# EAGLE design ocs-arduino-shield (EAGLE 7.1.0)
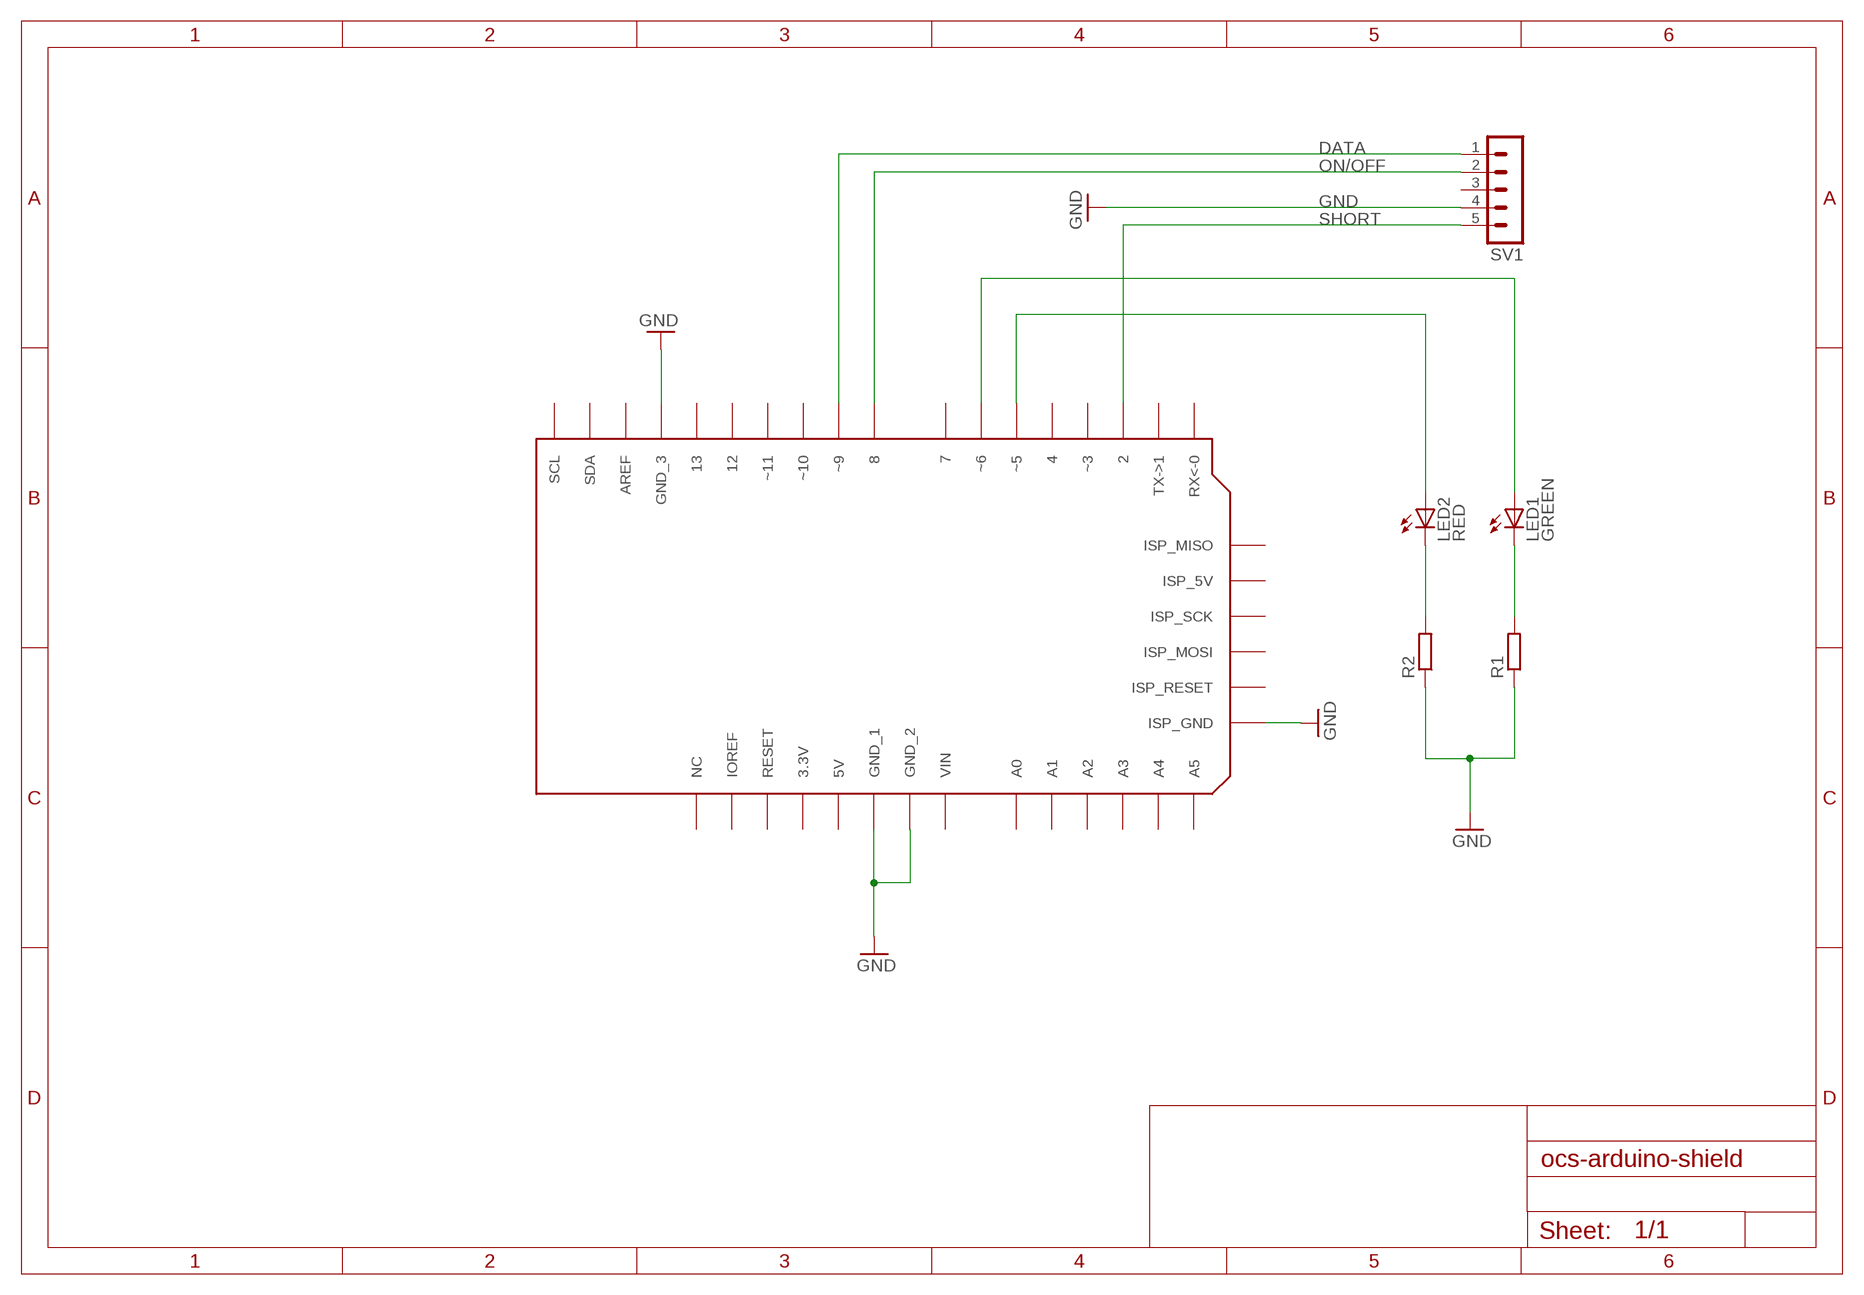
[diagram p0: schematic, sheet 1]

## Parts
LED1  GREEN  LED3MM  [LED3MM]
LED2  RED  LED3MM  [LED3MM]
R1  R-EU_0207_10  [0207/10]
R2  R-EU_0207_10  [0207/10]
SH1  ARDUINO-UNO-SHIELD  [ARDUINO-UNO-SHIELD]
SV1  MA05-1  [MA05-1]

## Nets
DATA: SH1.~9 SV1.1
GND: R1.1 R2.1 SH1.GND_1 SH1.GND_2 SH1.GND_3 SH1.ISP_GND SV1.4
N$1: LED1.A SH1.~6
N$2: LED2.A SH1.~5
N$3: LED2.K(C) R2.2
N$4: LED1.K(C) R1.2
ON/OFF: SH1.8 SV1.2
SHORT: SH1.2 SV1.5
Unconnected: SH1.3.3V SH1.4 SH1.5V SH1.7 SH1.12 SH1.13 SH1.A0 SH1.A1 SH1.A2 SH1.A3 SH1.A4 SH1.A5 SH1.AREF SH1.IOREF SH1.ISP_5V SH1.ISP_MISO SH1.ISP_MOSI SH1.ISP_RESET SH1.ISP_SCK SH1.NC SH1.RESET SH1.RX<-0 SH1.SCL SH1.SDA SH1.TX->1 SH1.VIN SH1.~3 SH1.~10 SH1.~11 SV1.3

## Library data of the parts
LED1 LED2 = led:LED: LED OSRAM: - CHIPLED LG R971, LG N971, LY N971, LG Q971, LY Q971, LO R971, LY R971 LH N974, LH R974 LS Q976, LO Q976, LY Q976 LO Q996 - Hyper CHIPLED LW Q18S LB Q993, LB Q99A, LB R99A - SideLED LS A670, LO A670, LY A670, LG A670, LP A670 LB A673, LV A673, LT A673, LW A673 LH A674 LY A675 LS A676, LA A676, LO A676, LY A676, LW A676 LS A679, LY A679, LG A679 - Hyper Micro SIDELED® LS Y876, LA Y876, LO Y876, LY Y876 LT Y87S - SmartLED LW L88C, LW L88S LB L89C, LB L89S, LG L890 LS L89K, LO L89K, LY L89K LS L896, LA L896, LO L896, LY L896 - TOPLED LS T670, LO T670, LY T670, LG T670, LP T670 LSG T670, LSP T670, LSY T670, LOP T670, LYG T670 LG T671, LOG T671, LSG T671 LB T673, LV T673, LT T673, LW T673 LH T674 LS T676, LA T676, LO T676, LY T676, LB T676, LH T676, LSB T676, LW T676 LB T67C, LV T67C, LT T67C, LS T67K, LO T67K, LY T67K, LW E67C LS E67B, LA E67B, LO E67B, LY E67B, LB E67C, LV E67C, LT E67C LW T67C LS T679, LY T679, LG T679 LS T770, LO T770, LY T770, LG T770, LP T770 LB T773, LV T773, LT T773, LW T773 LH T774 LS E675, LA E675, LY E675, LS T675 LS T776, LA T776, LO T776, LY T776, LB T776 LHGB T686 LT T68C, LB T68C - Hyper Mini TOPLED® LB M676 - Mini TOPLED Santana® LG M470 LS M47K, LO M47K, LY M47K Source: http://www.osram.convergy.de LUXEON: - LUMILED® LXK2-PW12-R00, LXK2-PW12-S00, LXK2-PW14-U00, LXK2-PW14-V00 LXK2-PM12-R00, LXK2-PM12-S00, LXK2-PM14-U00 LXK2-PE12-Q00, LXK2-PE12-R00, LXK2-PE12-S00, LXK2-PE14-T00, LXK2-PE14-U00 LXK2-PB12-K00, LXK2-PB12-L00, LXK2-PB12-M00, LXK2-PB14-N00, LXK2-PB14-P00, LXK2-PB14-Q00 LXK2-PR12-L00, LXK2-PR12-M00, LXK2-PR14-Q00, LXK2-PR14-R00 LXK2-PD12-Q00, LXK2-PD12-R00, LXK2-PD12-S00 LXK2-PH12-R00, LXK2-PH12-S00 LXK2-PL12-P00, LXK2-PL12-Q00, LXK2-PL12-R00 Source: www.luxeon.com KINGBRIGHT: KA-3528ASYC Source: www.kingbright.com
R1 R2 = resistor:R-EU_: RESISTOR, European symbol; SPICEPREFIX: R
SH1 = arduino-shield:ARDUINO-UNO-SHIELD: Arduino UNO Shield
SV1 = con-lstb:MA05-1: PIN HEADER; OC_FARNELL: unknown; OC_NEWARK: unknown

## Board
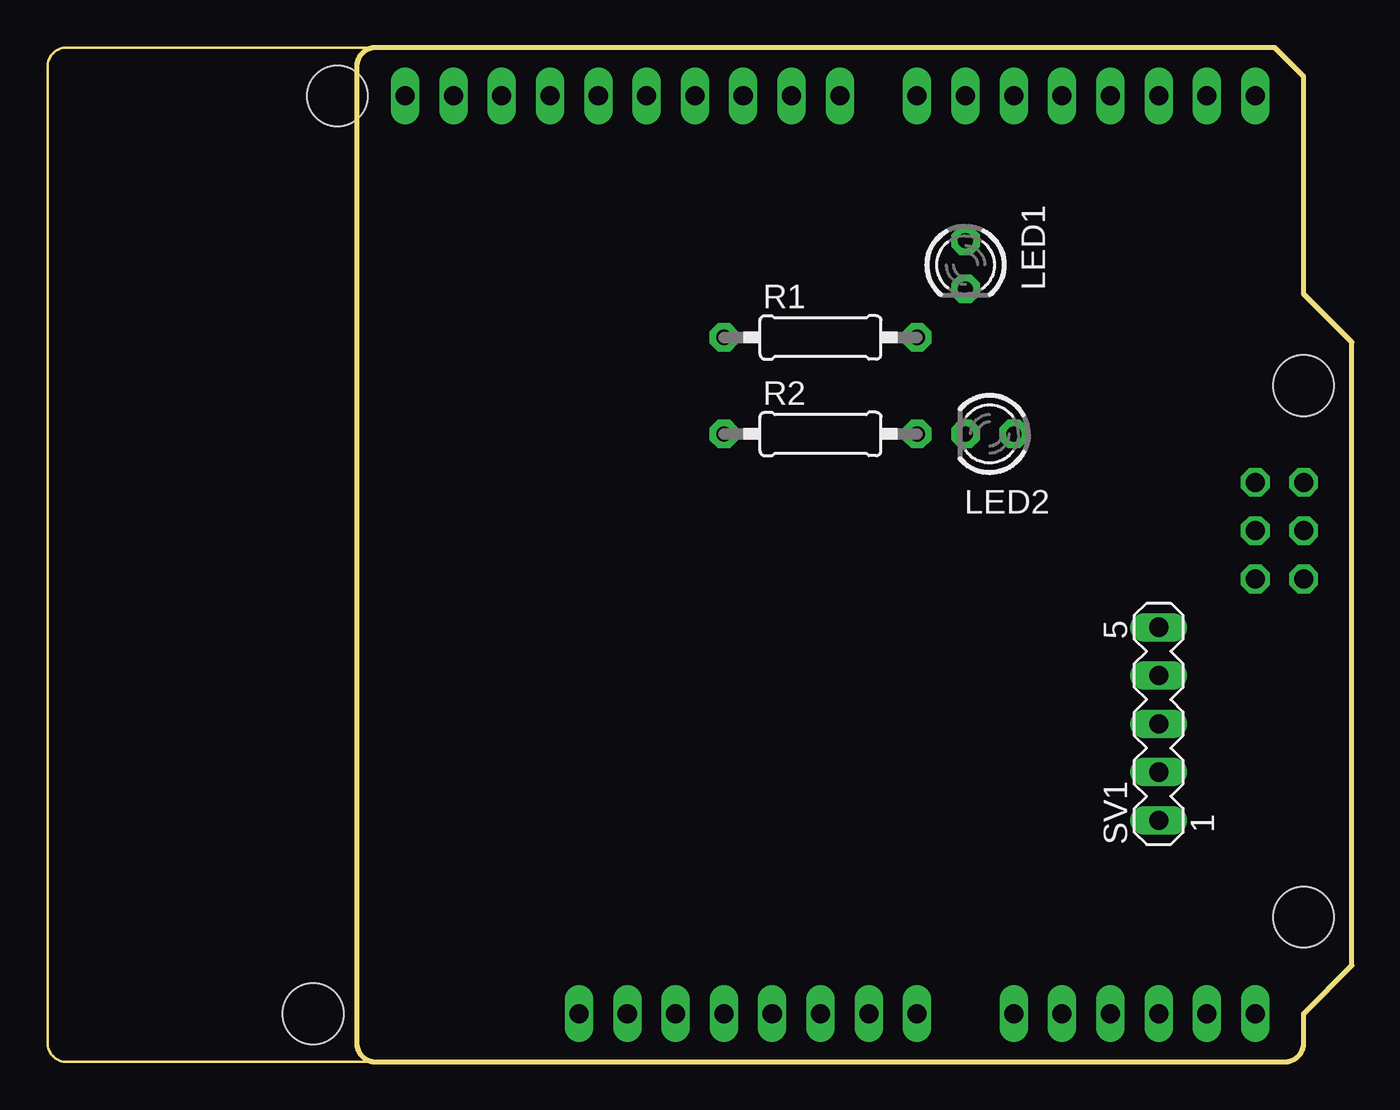
[diagram p1: board, top side]
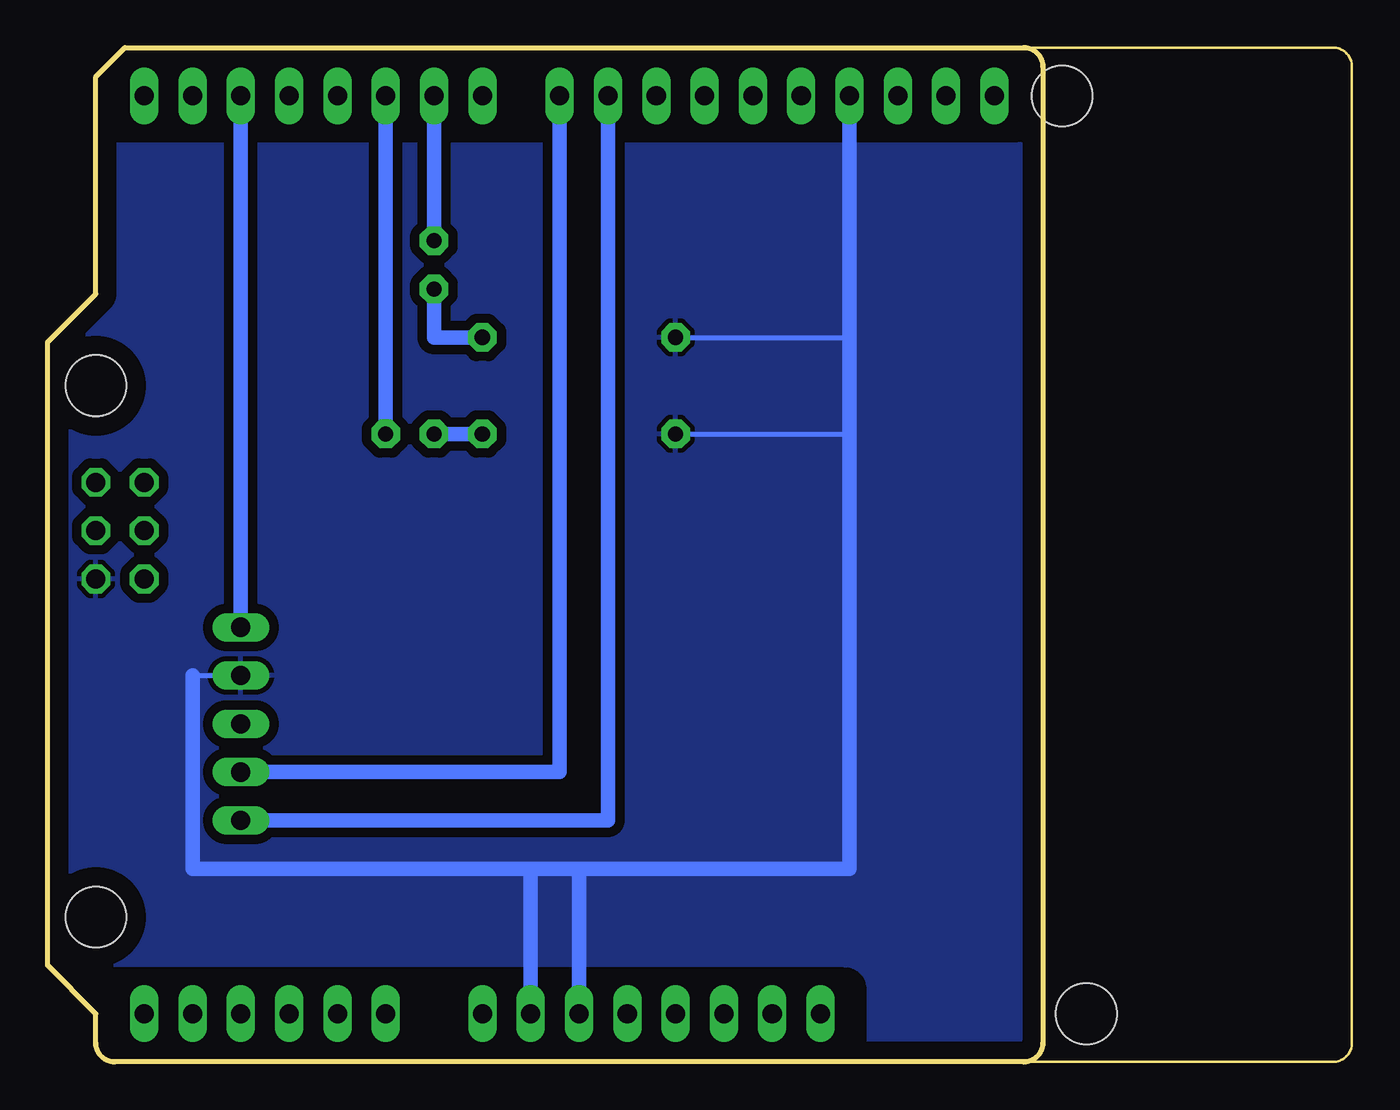
[diagram p2: board, bottom side, seen from below]

Size 68.58 x 53.34 mm. Coordinates in mm from the lower left corner, seen from the top.
Outline: 17.26,53.34 arc90 16.26,52.34 16.26,1 arc90 17.26,0
Copper layers (1*16): Top 0.035mm / dielectric 1.5mm / Bottom 0.035mm
Design rules "default": minimum track width 10mil, minimum drill 24mil, track to track 8mil, track to pad 8mil, pad to pad 8mil, via to via 8mil, smd to smd 8mil, copper to edge 40mil, drill to drill 8mil, minimum pad ring 10mil, minimum via ring 8mil, stop-mask expansion 4mil, vias tented up to drill 0mil, thermal gap 10mil
Milling: 12 lines

### Footprints (pad centres in the part's own frame; a part is rotated, then mirrored left to right if it is on the bottom)
LED3MM = drill 0.8 pad 1.5 octagon: A -1.27,0; K 1.27,0
0207/10 = drill 0.8 pad 1.5 octagon: 1 -5.08,0; 2 5.08,0
ARDUINO-UNO-SHIELD = drill 1 long: 2 58.42,50.8; 3.3V 35.56,2.54; 4 53.34,50.8; 5V 38.1,2.54; 7 45.72,50.8; 8 41.656,50.8; 12 31.496,50.8; 13 28.956,50.8; A0 50.8,2.54; A1 53.34,2.54; A2 55.88,2.54; A3 58.42,2.54; A4 60.96,2.54; A5 63.5,2.54; AREF 23.876,50.8; GND_1 40.64,2.54; GND_2 43.18,2.54; GND_3 26.416,50.8; IOREF 30.48,2.54; NC 27.94,2.54; RESET 33.02,2.54; RX<-0 63.5,50.8; SCL 18.796,50.8; SDA 21.336,50.8; TX->1 60.96,50.8; VIN 45.72,2.54; ~3 55.88,50.8; ~5 50.8,50.8; ~6 48.26,50.8; ~9 39.116,50.8; ~10 36.576,50.8; ~11 34.036,50.8 | drill 1 pad 1.5 octagon: ISP_5V 66.04,30.48; ISP_GND 66.04,25.4; ISP_MISO 63.5,30.48; ISP_MOSI 66.04,27.94; ISP_RESET 63.5,25.4; ISP_SCK 63.5,27.94 | hole 3.2: 66.04,35.56; 66.04,7.62; 15.24,50.8; 13.97,2.54
MA05-1 = drill 1 pad 1.5 long: 1 -5.08,0; 2 -2.54,0; 3 0,0; 4 2.54,0; 5 5.08,0

### Placement (x,y rotation side)
LED1  48.26,41.91 270 top
LED2  49.53,33.02 180 top
R1  40.64,38.1 0 top
R2  40.64,33.02 0 top
SH1  0,0 0 top
SV1  58.42,17.78 90 top

### Tracks (layer width: path | path; a pad name or v marks a point on that pad's centre or on a via)
DATA
  Bottom 0.75: SV1.1 39.12,12.7 SH1.~9
GND
  Bottom 0.25: 60.96,20.32 SV1.4 | R1.1 26.42,38.1 | R2.1 26.42,33.02
  Bottom 0.75: SH1.GND_3 26.42,38.1 26.42,33.02 26.42,10.16 40.64,10.16 | 40.64,10.16 43.18,10.16 | 43.18,10.16 60.96,10.16 60.96,20.32 | SH1.GND_1 40.64,10.16 | SH1.GND_2 43.18,10.16
  pour Bottom (isolate 0.5, rank 2): -2.54,-2.54 25.4,-2.54 25.4,3.81 arc-90 26.67,5.08 71.12,5.08 71.12,48.26 17.53,48.26 arc-90 16.26,49.53 16.26,55.88 -2.54,55.88
N$1
  Bottom 0.75: LED1.A SH1.~6
N$2
  Bottom 0.75: LED2.A SH1.~5
N$3
  Bottom 0.75: LED2.K R2.2
N$4
  Bottom 0.75: R1.2 48.26,38.1 LED1.K
ON/OFF
  Bottom 0.75: SV1.2 41.66,15.24 SH1.8
SHORT
  Bottom 0.75: SV1.5 SH1.2